# EAGLE schematic Shim_IWM (EAGLE 9.6.2)
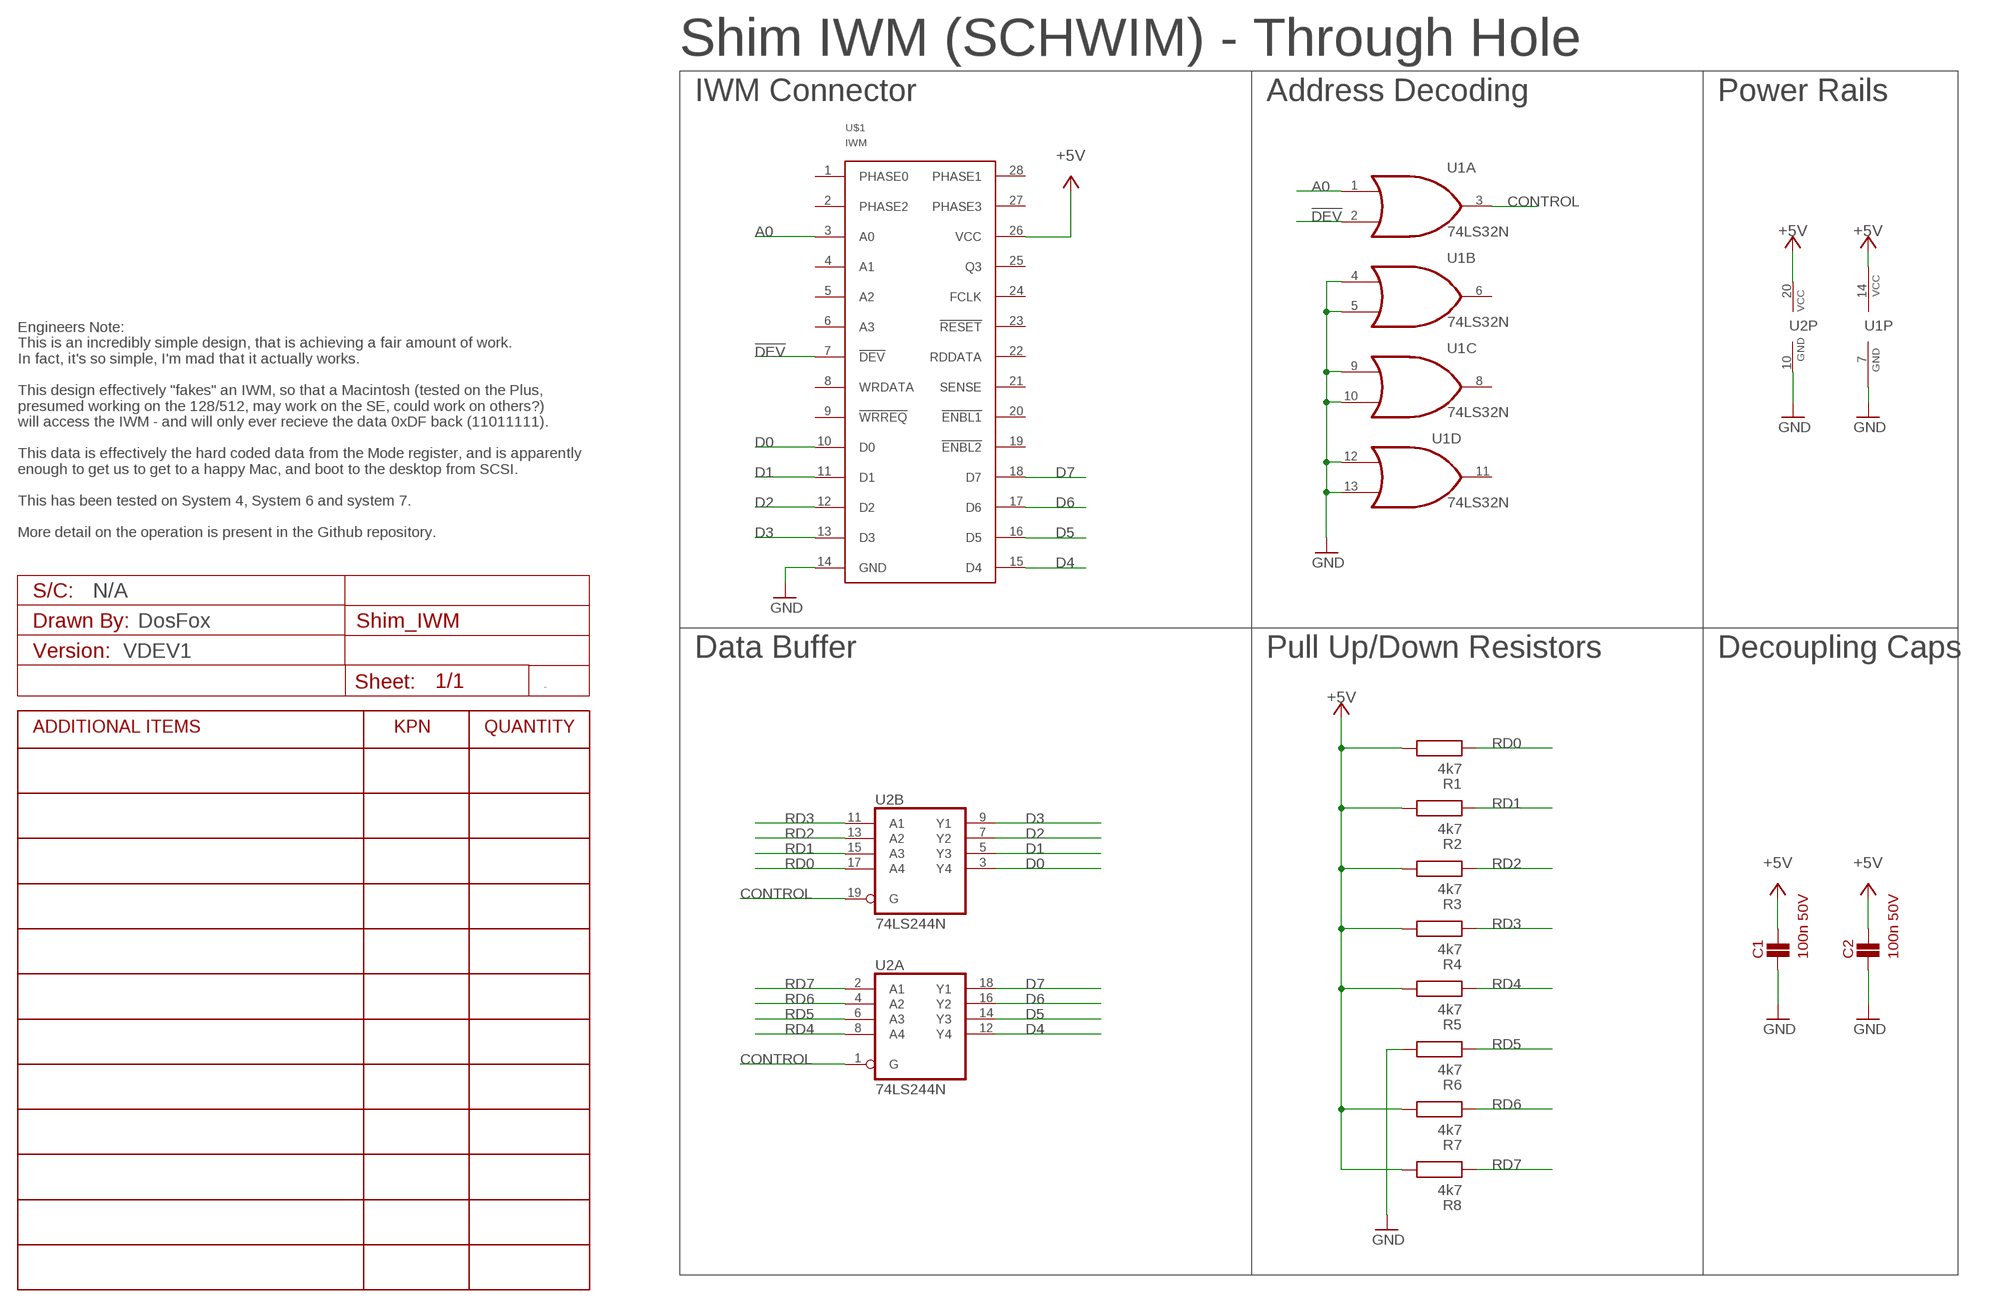
[diagram p0: schematic, sheet 1]

## Parts
A1  VDEV1  PROJECT_DETAILS_CUSTOM  [PCB_CUSTOM_DETAILS]
C1  100n 50V  100N_TH_CAP  [CAP_5.08MM_PITCH]
C2  100n 50V  100N_TH_CAP  [CAP_5.08MM_PITCH]
R1  4k7  4K7_TH_RESISTOR  [RESISTORTHRUHOLE]
R2  4k7  4K7_TH_RESISTOR  [RESISTORTHRUHOLE]
R3  4k7  4K7_TH_RESISTOR  [RESISTORTHRUHOLE]
R4  4k7  4K7_TH_RESISTOR  [RESISTORTHRUHOLE]
R5  4k7  4K7_TH_RESISTOR  [RESISTORTHRUHOLE]
R6  4k7  4K7_TH_RESISTOR  [RESISTORTHRUHOLE]
R7  4k7  4K7_TH_RESISTOR  [RESISTORTHRUHOLE]
R8  4k7  4K7_TH_RESISTOR  [RESISTORTHRUHOLE]
U1  74LS32N  [DIL14]
U2  74LS244N  [DIL20]
U$1  IWM  [DIP28]

## Nets
!DEV: U1.2(A:I1) U$1.7(!DEV)
+5V: C1.P$2 C2.P$2 R1.P$2 R2.P$2 R3.P$2 R4.P$2 R5.P$2 R7.P$2 R8.P$2 U1.14(P:VCC) U2.20(P:VCC) U$1.26(VCC) ; supply symbol labelled VCC
A0: U1.1(A:I0) U$1.3(A0)
CONTROL: U1.3(A:O) U2.1(A:G) U2.19(B:G)
D0: U2.3(B:Y4) U$1.10(D0)
D1: U2.5(B:Y3) U$1.11(D1)
D2: U2.7(B:Y2) U$1.12(D2)
D3: U2.9(B:Y1) U$1.13(D3)
D4: U2.12(A:Y4) U$1.15(D4)
D5: U2.14(A:Y3) U$1.16(D5)
D6: U2.16(A:Y2) U$1.17(D6)
D7: U2.18(A:Y1) U$1.18(D7)
GND: C1.P$1 C2.P$1 R6.P$2 U1.4(B:I0) U1.5(B:I1) U1.7(P:GND) U1.9(C:I0) U1.10(C:I1) U1.12(D:I0) U1.13(D:I1) U2.10(P:GND) U$1.14(GND)
RD0: R1.P$1 U2.17(B:A4)
RD1: R2.P$1 U2.15(B:A3)
RD2: R3.P$1 U2.13(B:A2)
RD3: R4.P$1 U2.11(B:A1)
RD4: R5.P$1 U2.8(A:A4)
RD5: R6.P$1 U2.6(A:A3)
RD6: R7.P$1 U2.4(A:A2)
RD7: R8.P$1 U2.2(A:A1)
Unconnected: U1.6(B:O) U1.8(C:O) U1.11(D:O) U$1.1(PHASE0) U$1.2(PHASE2) U$1.4(A1) U$1.5(A2) U$1.6(A3) U$1.8(WRDATA) U$1.9(!WRREQ) U$1.19(!ENBL2) U$1.20(!ENBL1) U$1.21(SENSE) U$1.22(RDDATA) U$1.23(!RESET) U$1.24(FCLK) U$1.25(Q3) U$1.27(PHASE3) U$1.28(PHASE1)

## Notes on the sheet
- Shim IWM (SCHWIM) - Through Hole
- IWM Connector | Address Decoding | Power Rails
- Engineers Note:
  This is an incredibly simple design, that is achieving a fair amount of work. 
  In fact, it's so simple, I'm mad that it actually works. 
  
  This design effectively "fakes" an IWM, so that a Macintosh (tested on the Plus,
  presumed working on the 128/512, may work on the SE, could work on others?)
  will access the IWM - and will only ever recieve the data 0xDF back (11011111). 
  
  This data is effectively the hard coded data from the Mode register, and is apparently
  enough to get us to get to a happy Mac, and boot to the desktop from SCSI.
  
  This has been tested on System 4, System 6 and system 7. 
  
  More detail on the operation is present in the Github repository.
- N/A
- DosFox
- Data Buffer | Pull Up/Down Resistors | Decoupling Caps

## Library data of the parts
A1 = Schematic Symbols:PROJECT_DETAILS
C1 C2 = Capacitors TH:100N_TH_CAP; COMPONENT: Capacitor; COST: =(INDIRECT(ADDRESS(ROW(),1)))*(INDIRECT(ADDRESS(ROW(),13))); EA: =VLOOKUP(INDIRECT(ADDRESS(ROW(),7)),[ProductCosts.xlsx]StockCosts!$A:$B,2,FALSE); KPN: 3101-100N; PACKAGE: 5.08mm PITCH; PROCESS: TH
R1-R8 = Resistors TH:4K7_TH_RESISTOR; COMPONENT: Resistor; COST: =(INDIRECT(ADDRESS(ROW(),1)))*(INDIRECT(ADDRESS(ROW(),13))); EA: =(VLOOKUP(INDIRECT(ADDRESS(ROW(),6)),[ProductCosts.xlsx]StockCosts!$A:$B,2,FALSE))/1000; KPN: 3004-4k7; PACKAGE: Axial Leaded; PROCESS: TH
U1 = 74xx-us:74*32: Quad 2-input OR gate
U2 = 74xx-eu:74*244: Octal BUFFER and LINE DRIVER, 3-state
U$1 = ICs:IWM